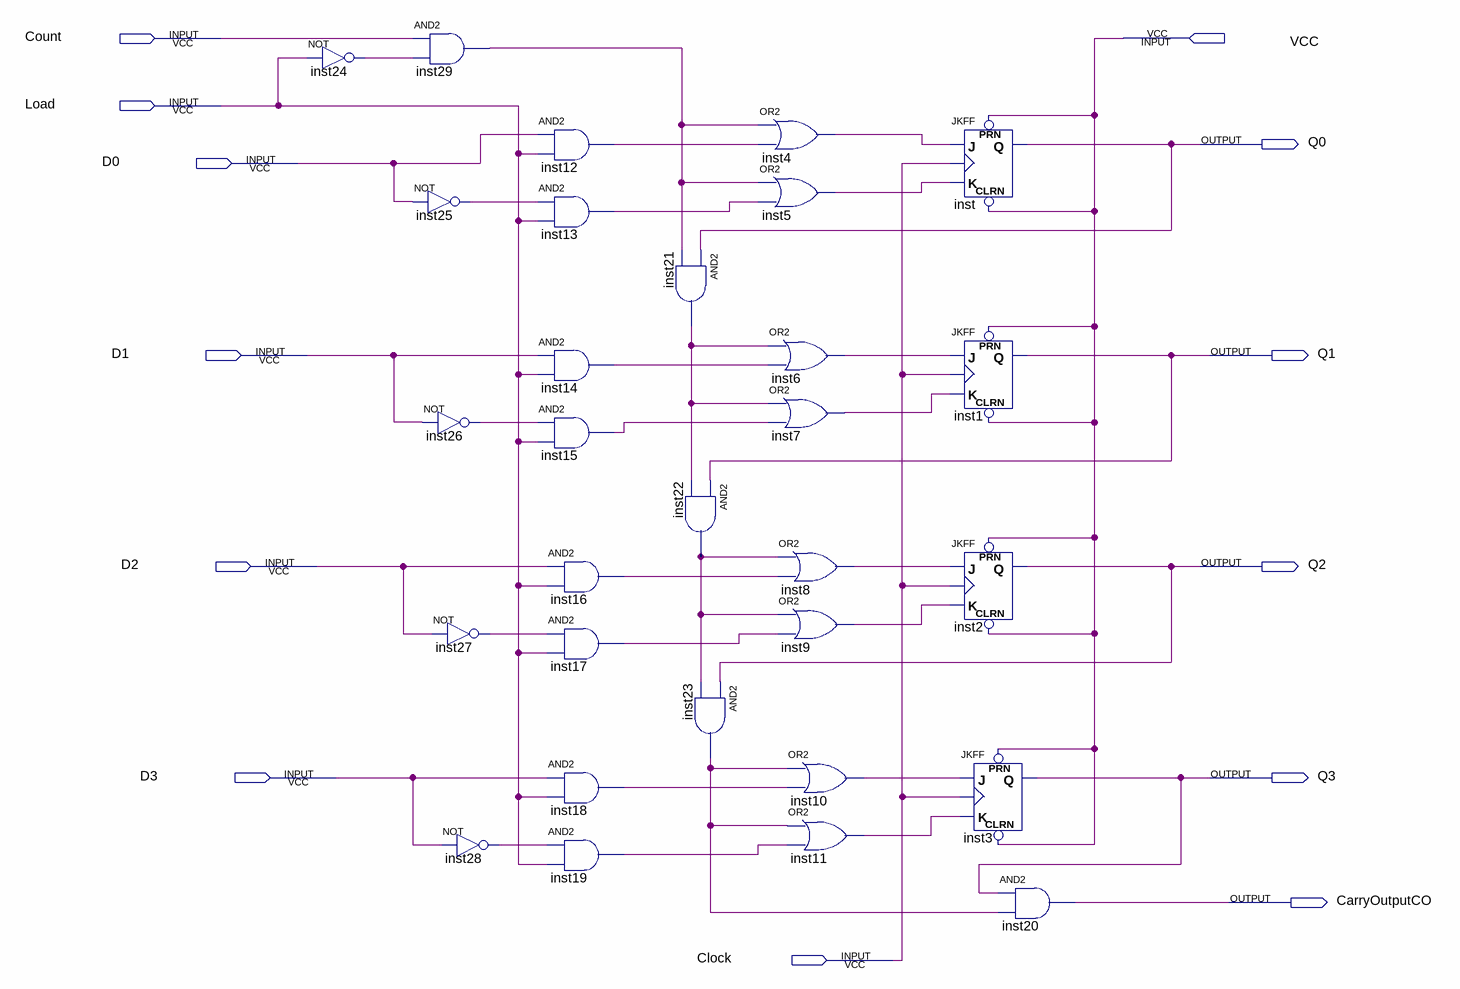
[diagram p0: schematic sheet]
// Quartus schematic 4bitCounter.bdf as structural Verilog: 30 symbols, 13 pins
module \4bitCounter  (
  input  Count,
  input  VCC,
  input  Load,
  input  D0,
  input  D1,
  input  D2,
  input  D3,
  input  Clock,
  output Q0,
  output Q1,
  output Q2,
  output Q3,
  output CarryOutputCO
);

  wire inst4_out, inst5_out, inst6_out, inst7_out, inst8_out, inst9_out, inst10_out, inst11_out, inst12_out,
       inst13_out, inst14_out, inst15_out, inst16_out, inst17_out, inst18_out, inst19_out, inst21_out,
       inst22_out, inst23_out, inst24_out, inst25_out, inst26_out, inst27_out, inst28_out, inst29_out;

  not inst24 (inst24_out, Load);
  and inst29 (inst29_out, Count, inst24_out);
  not inst25 (inst25_out, D0);
  not inst26 (inst26_out, D1);
  not inst27 (inst27_out, D2);
  not inst28 (inst28_out, D3);
  and inst12 (inst12_out, D0, Load);
  and inst13 (inst13_out, inst25_out, Load);
  and inst14 (inst14_out, D1, Load);
  and inst15 (inst15_out, inst26_out, Load);
  and inst16 (inst16_out, D2, Load);
  and inst17 (inst17_out, inst27_out, Load);
  and inst18 (inst18_out, D3, Load);
  and inst19 (inst19_out, inst28_out, Load);
  and inst21 (inst21_out, Q0, inst29_out);
  and inst22 (inst22_out, Q1, inst21_out);
  and inst23 (inst23_out, Q2, inst22_out);
  or inst4 (inst4_out, inst29_out, inst12_out);
  or inst5 (inst5_out, inst29_out, inst13_out);
  or inst6 (inst6_out, inst21_out, inst14_out);
  or inst7 (inst7_out, inst21_out, inst15_out);
  or inst8 (inst8_out, inst22_out, inst16_out);
  or inst9 (inst9_out, inst22_out, inst17_out);
  or inst10 (inst10_out, inst23_out, inst18_out);
  or inst11 (inst11_out, inst23_out, inst19_out);
  JKFF inst (.PRN(VCC), .CLRN(VCC), .K(inst5_out), .J(inst4_out), .CLK(Clock), .Q(Q0));
  JKFF inst1 (.PRN(VCC), .CLRN(VCC), .K(inst7_out), .J(inst6_out), .CLK(Clock), .Q(Q1));
  JKFF inst2 (.PRN(VCC), .CLRN(VCC), .K(inst9_out), .J(inst8_out), .CLK(Clock), .Q(Q2));
  JKFF inst3 (.PRN(VCC), .CLRN(VCC), .K(inst11_out), .J(inst10_out), .CLK(Clock), .Q(Q3));
  and inst20 (CarryOutputCO, Q3, inst23_out);
endmodule
